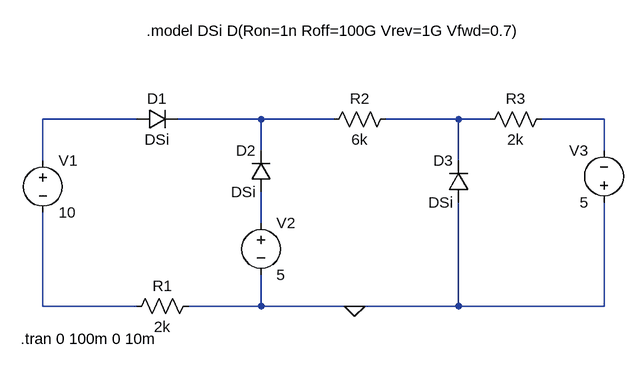
[diagram p0: schematic Prova2024_1_3.asc]
Prova2024_1_3.asc, the LTspice schematic file:
Version 4
SHEET 1 916 680
WIRE 160 64 16 64
WIRE 352 64 224 64
WIRE 464 64 352 64
WIRE 656 64 544 64
WIRE 704 64 656 64
WIRE 880 64 784 64
WIRE 352 112 352 64
WIRE 880 112 880 64
WIRE 16 128 16 64
WIRE 656 128 656 64
WIRE 352 224 352 176
WIRE 16 352 16 208
WIRE 160 352 16 352
WIRE 352 352 352 304
WIRE 352 352 240 352
WIRE 496 352 352 352
WIRE 656 352 656 192
WIRE 656 352 496 352
WIRE 880 352 880 192
WIRE 880 352 656 352
FLAG 496 352 0
SYMBOL voltage 16 112 R0
SYMATTR InstName V1
SYMATTR Value 10
SYMBOL diode 160 80 R270
WINDOW 0 32 32 VTop 2
WINDOW 3 0 32 VBottom 2
SYMATTR InstName D1
SYMATTR Value DSi
SYMBOL diode 368 176 R180
WINDOW 0 24 64 Left 2
WINDOW 3 24 0 Left 2
SYMATTR InstName D2
SYMATTR Value DSi
SYMBOL diode 672 192 R180
WINDOW 0 24 64 Left 2
WINDOW 3 24 0 Left 2
SYMATTR InstName D3
SYMATTR Value DSi
SYMBOL voltage 880 208 R180
WINDOW 0 24 96 Left 2
WINDOW 3 24 16 Left 2
SYMATTR InstName V3
SYMATTR Value 5
SYMBOL voltage 352 208 R0
WINDOW 123 0 0 Left 0
WINDOW 39 0 0 Left 0
SYMATTR InstName V2
SYMATTR Value 5
SYMBOL res 256 336 R90
WINDOW 0 0 56 VBottom 2
WINDOW 3 32 56 VTop 2
SYMATTR InstName R1
SYMATTR Value 2k
SYMBOL res 560 48 R90
WINDOW 0 0 56 VBottom 2
WINDOW 3 32 56 VTop 2
SYMATTR InstName R2
SYMATTR Value 6k
SYMBOL res 800 48 R90
WINDOW 0 0 56 VBottom 2
WINDOW 3 32 56 VTop 2
SYMATTR InstName R3
SYMATTR Value 2k
TEXT 176 -72 Left 2 !.model DSi D(Ron=1n Roff=100G Vrev=1G Vfwd=0.7)
TEXT -18 402 Left 2 !.tran 0 100m 0 10m

The netlist it stands for:
* Prova2024_1_3.asc
V1 N001 N006 10
D1 N001 N002 DSi
D2 N005 N002 DSi
D3 0 N003 DSi
V3 0 N004 5
V2 N005 0 5
R1 0 N006 2k
R2 N003 N002 6k
R3 N004 N003 2k
.model D D
.lib standard.dio
.model DSi D(Ron=1n Roff=100G Vrev=1G Vfwd=0.7)
.tran 0 100m 0 10m
.backanno
.end